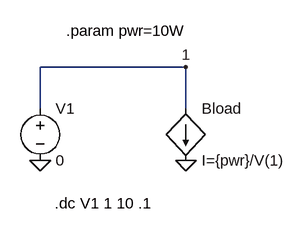
[diagram p0: schematic Param.asc]
Param.asc, the LTspice schematic file:
Version 4
SHEET 1 880 680
WIRE -128 176 -128 112
WIRE -128 112 96 112
WIRE 96 112 96 176
FLAG -128 256 0
FLAG 96 256 0
FLAG 96 112 1
SYMBOL voltage -128 160 R0
WINDOW 123 0 0 Left 0
WINDOW 39 0 0 Left 0
SYMATTR InstName V1
SYMATTR Value 0
SYMBOL bi 96 176 R0
SYMATTR InstName Bload
SYMATTR Value I={pwr}/V(1)
TEXT -88 56 Left 0 !.param pwr=10W
TEXT -106 322 Left 0 !.dc V1 1 10 .1

The netlist it stands for:
* Param.asc
V1 1 0 0
Bload 1 0 I={pwr}/V(1)
.param pwr=10W
.dc V1 1 10 .1
.backanno
.end